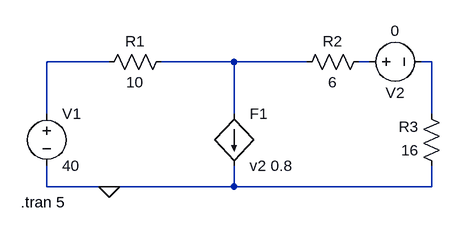
[diagram p0: schematic Q03.asc]
Q03.asc, the LTspice schematic file:
Version 4
SHEET 1 880 680
WIRE 144 48 48 48
WIRE 336 48 224 48
WIRE 448 48 336 48
WIRE 544 48 528 48
WIRE 640 48 624 48
WIRE 48 128 48 48
WIRE 336 128 336 48
WIRE 640 128 640 48
WIRE 48 240 48 208
WIRE 144 240 48 240
WIRE 336 240 336 208
WIRE 336 240 144 240
WIRE 640 240 640 208
WIRE 640 240 336 240
FLAG 144 240 0
SYMBOL voltage 48 112 R0
WINDOW 123 0 0 Left 0
WINDOW 39 0 0 Left 0
SYMATTR InstName V1
SYMATTR Value 40
SYMBOL res 240 32 R90
WINDOW 0 0 56 VBottom 2
WINDOW 3 32 56 VTop 2
SYMATTR InstName R1
SYMATTR Value 10
SYMBOL res 544 32 R90
WINDOW 0 0 56 VBottom 2
WINDOW 3 32 56 VTop 2
SYMATTR InstName R2
SYMATTR Value 6
SYMBOL res 656 224 R180
WINDOW 0 36 76 Left 2
WINDOW 3 36 40 Left 2
SYMATTR InstName R3
SYMATTR Value 16
SYMBOL f 336 128 R0
SYMATTR InstName F1
SYMATTR Value v2 0.8
SYMBOL voltage 528 48 R270
WINDOW 0 -32 56 VBottom 2
WINDOW 3 32 56 VTop 2
WINDOW 123 0 0 Left 0
WINDOW 39 0 0 Left 0
SYMATTR InstName V2
SYMATTR Value 0
TEXT 8 264 Left 2 !.tran 5

The netlist it stands for:
* Q03.asc
V1 N001 0 40
R1 N002 N001 10
R2 N003 N002 6
R3 0 N004 16
F1 N002 0 v2 0.8
V2 N003 N004 0
.tran 5
.backanno
.end